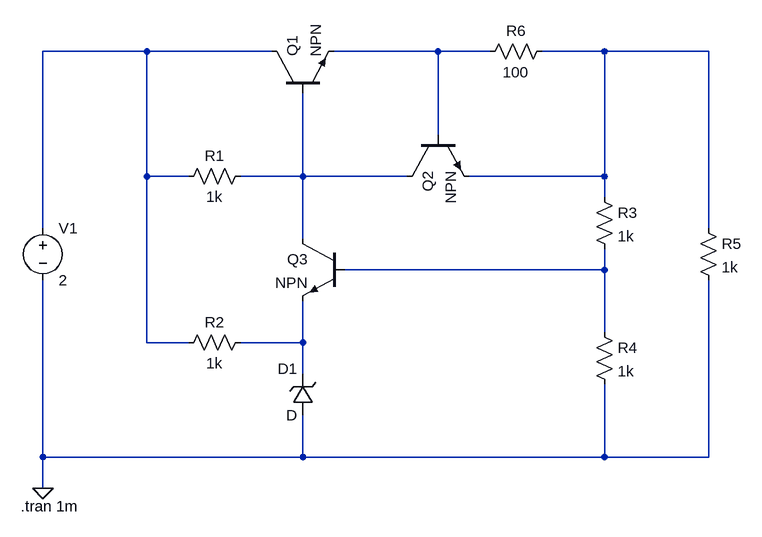
[diagram p0: schematic CurrentLimitingCircuit.asc]
CurrentLimitingCircuit.asc, the LTspice schematic file:
Version 4
SHEET 1 916 832
WIRE -80 112 -240 112
WIRE 112 112 -80 112
WIRE 368 112 208 112
WIRE 448 112 368 112
WIRE 624 112 528 112
WIRE 784 112 624 112
WIRE 368 240 368 112
WIRE -80 304 -80 112
WIRE -16 304 -80 304
WIRE 160 304 160 176
WIRE 160 304 64 304
WIRE 320 304 160 304
WIRE 624 304 624 112
WIRE 624 304 416 304
WIRE 624 336 624 304
WIRE -240 384 -240 112
WIRE 784 384 784 112
WIRE 160 400 160 304
WIRE 624 448 624 416
WIRE 624 448 224 448
WIRE 624 544 624 448
WIRE -80 560 -80 304
WIRE -16 560 -80 560
WIRE 160 560 160 496
WIRE 160 560 64 560
WIRE 160 608 160 560
WIRE -240 736 -240 464
WIRE 160 736 160 672
WIRE 160 736 -240 736
WIRE 624 736 624 624
WIRE 624 736 160 736
WIRE 784 736 784 464
WIRE 784 736 624 736
WIRE -240 784 -240 736
FLAG -240 784 0
SYMBOL npn 112 176 R270
SYMATTR InstName Q1
SYMBOL npn 320 240 M90
SYMATTR InstName Q2
SYMBOL npn 224 400 M0
SYMATTR InstName Q3
SYMBOL res -32 320 R270
WINDOW 0 32 56 VTop 0
WINDOW 3 0 56 VBottom 0
SYMATTR InstName R1
SYMATTR Value 1k
SYMBOL res -32 576 R270
WINDOW 0 32 56 VTop 0
WINDOW 3 0 56 VBottom 0
SYMATTR InstName R2
SYMATTR Value 1k
SYMBOL res 608 320 R0
SYMATTR InstName R3
SYMATTR Value 1k
SYMBOL res 608 528 R0
SYMATTR InstName R4
SYMATTR Value 1k
SYMBOL res 768 368 R0
SYMATTR InstName R5
SYMATTR Value 1k
SYMBOL res 432 128 R270
WINDOW 0 32 56 VTop 0
WINDOW 3 0 56 VBottom 0
SYMATTR InstName R6
SYMATTR Value 100
SYMBOL voltage -240 368 R0
WINDOW 123 0 0 Left 0
WINDOW 39 0 0 Left 0
SYMATTR InstName V1
SYMATTR Value 2
SYMBOL zener 176 672 R180
WINDOW 0 24 72 Left 0
WINDOW 3 24 0 Left 0
SYMATTR InstName D1
TEXT -274 812 Left 0 !.tran 1m

The netlist it stands for:
* CurrentLimitingCircuit.asc
Q1 N001 N004 N002 0 NPN
Q2 N004 N002 N003 0 NPN
Q3 N004 N005 N006 0 NPN
R1 N001 N004 1k
R2 N001 N006 1k
R3 N003 N005 1k
R4 N005 0 1k
R5 N003 0 1k
R6 N002 N003 100
V1 N001 0 2
D1 0 N006 D
.model D D
.lib standard.dio
.model NPN NPN
.model PNP PNP
.lib standard.bjt
.tran 1m
.backanno
.end